# Altium schematic sheet 24V_input.SchDoc
size A4; SheetNumber: 14; SheetTotal: 14
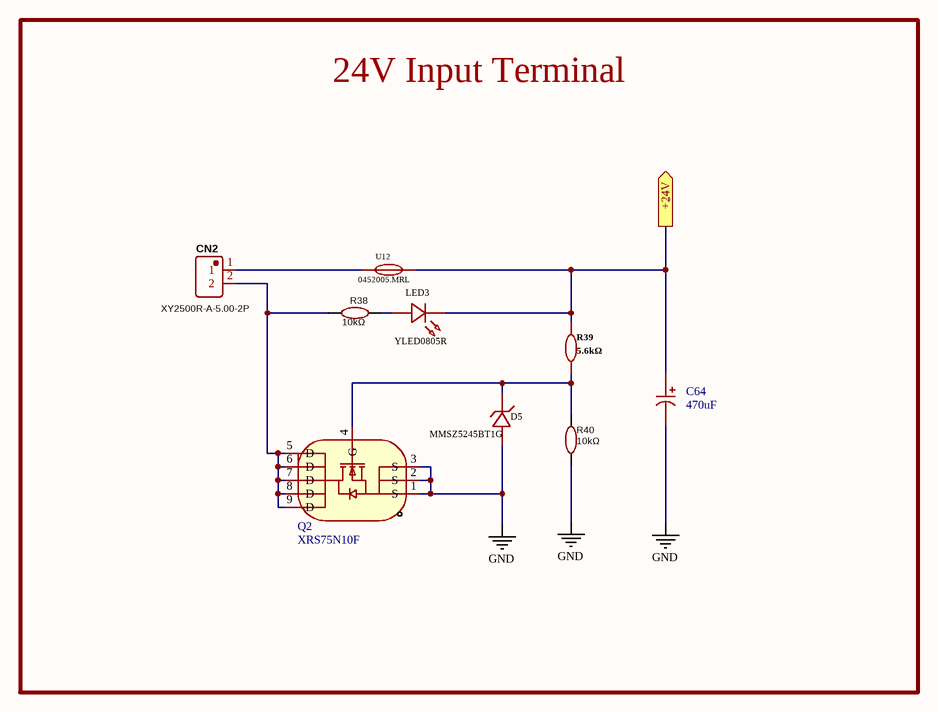
[diagram p0: 24V_input.SchDoc]

## Parts
C64  470uF  [CAP-TH_BD10.0-P5.00-D0.6-FD_1]
CN2  XY2500R-A-5.00-2P  [CONN-TH_XY2500R-A-5.00-2P]
D5  MMSZ5245BT1G  [SOD-123_L2.7-W1.6-LS3.7-RD]
LED3  YLED0805R  [LED0805-RD_RED]
Q2  XRS75N10F  [PDFN-8_L5.8-W5.0-P1.27-LS6.1-BL]
R38  10kΩ  [R_0603]
R39  5.6kΩ  [R_0603]
R40  10kΩ  [R_0603]
U12  0452005.MRL  [FUSE-SMD_L6.1-W2.7]

## Blocks framed on the sheet
24V Input Terminal: C64 CN2 D5 LED3 Q2 R38-R40 U12

## Ports
+24V (out)

## Nets
GND: C64.2 D5.2(A) Q2.1(S) Q2.2(S) Q2.3(S) R40.2
+24V: C64.1 LED3.1(K) R39.2 U12.2 ; port +24V
NetCN2_1: CN2.1 U12.1
NetCN2_2: CN2.2 Q2.5(D) Q2.6(D) Q2.7(D) Q2.8(D) Q2.9(D) R38.2
NetD5_1: D5.1(K) Q2.4(G) R39.1 R40.1
NetLED3_2: LED3.2(A) R38.1

## Notes on the sheet
- Project Name:
- Size:
- Date:
- A4
- Version:
- Time:
- V1.4.0.0
- Sheet:
- Of
- File:

## Library data of the parts
C64 = ERG35V470M10X16: Manufacturer: JIERR(捷而瑞); Add into BOM: yes; Tolerance: ±20%; Voltage Rating: 35V; Ripple Current: 1.326A@100kHz; Equivalent Series Resistance(ESR): 46mΩ@100kHz; Pin Spacing: 5mm; Lifetime: 2000hrs@105℃; Symbol: ERG35V470M10X16; Device: ERG35V470M10X16; LCSC Part Name: 470uF ±20% 35V; Supplier Part: C48935386; Manufacturer Part: ERG35V470M10X16; Supplier Footprint: 插件,D10xL16mm; JLCPCB Part Class: Extended Part; Datasheet: https://item.szlcsc.com/datasheet/ERG35V470M10X16/51248506.html; Supplier: LCSC; Convert to PCB: yes; Value: 470uF; Diameter: 10mm; Height - Seated (Max): 16mm; Operating Temperature: -40℃~+105℃
CN2 = XY2500R-A-5.00-2P: Manufacturer: XINLAIYA(新莱亚); Contributor: LCSC; Supplier: LCSC; Supplier Part: C505797; Manufacturer Part: XY2500R-A-5.00-2P; JLCPCB Part Class: Extended Part; spicePre: C; spiceSymbolName: XY2500R-A-5.00-2P
D5 = MMSZ5245BT1G: Manufacturer: onsemi(安森美); Add into BOM: yes; Diode Configuration: Independent; Zener Voltage(Nom): 15V; Reverse Leakage Current (Ir): 100nA@11V; Zener Voltage(Range): 14.25V~15.75V; Pd - Power Dissipation: 500mW; Impedance(Zzt): 16Ω; Impedance(Zzk): 600Ω; Operating Junction Temperature Range: -55℃~+150℃; Symbol: MMSZ5245BT1G; Device: MMSZ5245BT1G; LCSC Part Name: 独立式 耐压:15V 电流:0.1uA@11V; Supplier Part: C129730; Manufacturer Part: MMSZ5245BT1G; Supplier Footprint: SOD-123; JLCPCB Part Class: Extended Part; Datasheet: https://item.szlcsc.com/datasheet/MMSZ5245BT1G/141016.html; Supplier: LCSC; Convert to PCB: yes
LED3 = YLED0805R: Manufacturer: YONGYUTAI(永裕泰); Add into BOM: yes; Emitted Color: Red; Forward Voltage (VF): 1.8V~2.4V; Power Dissipation: 60mW; Forward Current: 20mA; Dominant Wavelength: 615nm~630nm; Peak Wavelength: 645nm; Symbol: YLED0805R; Device: YLED0805R; LCSC Part Name: YLED0805R; Supplier Part: C19171391; Manufacturer Part: YLED0805R; Supplier Footprint: 0805; JLCPCB Part Class: Extended Part; Datasheet: https://atta.szlcsc.com/upload/public/pdf/source/20231027/AB486D22E6D71BC59190C48A798367E6.pdf; Supplier: LCSC; Convert to PCB: yes; Diode Configuration: -; Lens Color: -; Color Temperature: -; Luminous Intensity: -; Viewing Angle: -; Mounting Sytle: -; Operating Temperature: -40℃~+85℃
Q2 = XRS75N10F: Manufacturer: XNRUSEMI(新锐); Add into BOM: yes; Drain to Source Voltage: 100V; Current - Continuous Drain(Id): 75A; RDS(on): 7.75mΩ@10V; Pd - Power Dissipation: 108W; Gate Threshold Voltage (Vgs(th)): 2.3V@250uA; Gate Charge(Qg): 32.1nC@10V; Input Capacitance(Ciss): 1.916nF; Reverse Transfer Capacitance (Crss@Vds): 17pF; Type: N-Channel; Output Capacitance(Coss): 602pF; Symbol: XRS75N10F; Device: XRS75N10F; LCSC Part Name: N沟道100V快速开关MOSFET; Supplier Part: C47325010; Manufacturer Part: XRS75N10F; Supplier Footprint: PDFN5060-8L; JLCPCB Part Class: Extended Part; Datasheet: https://item.szlcsc.com/datasheet/XRS75N10F/49533440.html; Supplier: LCSC; Convert to PCB: yes; Operating Temperature: -55℃~+150℃
R38 R40 = 10kΩ: Manufacturer: YAGEO(国巨); Manufacturer Part: RC0603FR-0710KL; nameAlias: Value; Supplier: LCSC; Supplier Part: C98220; JLCPCB Part Class: Extended Part; spicePre: R; spiceSymbolName: RC0603FR-0710KL
R39 = 0603WAF5601T5E: Manufacturer: UNI-ROYAL(厚声); Add into BOM: yes; Tolerance: ±1%; Power(Watts): 100mW; Voltage-Supply(Max): 75V; Temperature Coefficient: ±100ppm/℃; Symbol: 0603WAF5601T5E; Device: 0603WAF5601T5E; Supplier: LCSC; Manufacturer Part: 0603WAF5601T5E; Supplier Part: C23189; Value: 5.6kΩ; JLCPCB Part Class: Basic Part; LCSC Part Name: 5.6kΩ ±1% 100mW 厚膜电阻; Supplier Footprint: 0603; Datasheet: https://item.szlcsc.com/datasheet/0603WAF5601T5E/23916.html; Convert to PCB: yes; Type: Thick Film Resistor; Operating Temperature: -55℃~+155℃
U12 = 0452005.MRL: Manufacturer: Littelfuse(美国力特); Add into BOM: yes; Current Rating: 5A; Voltage Rating  (AC): 125V; Breaking Capacity: 50A; Symbol: 0452005.MRL; Device: 0452005.MRL; Supplier: LCSC; Manufacturer Part: 0452005.MRL; Supplier Part: C66503; JLCPCB Part Class: Extended Part; LCSC Part Name: 125V贴片式保险丝; Supplier Footprint: SMD,6.1x2.7mm; Datasheet: https://atta.szlcsc.com/upload/public/pdf/source/20171201/C151124_15121178420491156381.pdf; Convert to PCB: yes; Type: SMD Fuse; Voltage Rating (DC): 125V; Operating Temperature: -55℃~+125℃